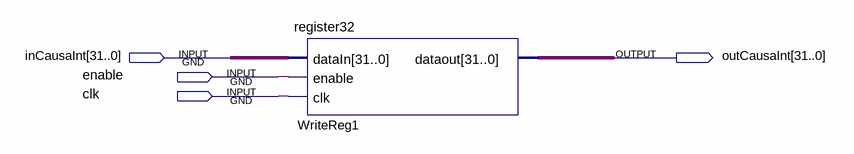
[diagram p0: schematic sheet]
// Quartus schematic CausaInt.bdf as structural Verilog: 1 symbols, 4 pins
module CausaInt (
  input  [31:0] inCausaInt,
  input  enable,
  input  clk,
  output [31:0] outCausaInt
);

  register32 WriteReg1 (.dataIn(inCausaInt), .enable(enable), .clk(clk), .dataout(outCausaInt));

  // Other names for the same wires on the sheet: vcc = enable
endmodule
